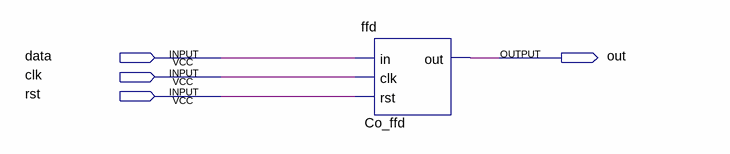
[diagram p0: schematic sheet]
// Quartus schematic register1bit.bdf as structural Verilog: 1 symbols, 4 pins
module register1bit (
  input  data,
  input  clk,
  input  rst,
  output out
);

  ffd Co_ffd (.in(data), .clk(clk), .rst(rst), .out(out));
endmodule
